# Altium schematic sheet I2C IO Expander.SchDoc: I2C I/O Expander
size 292 x 193 mm; SheetNumber: 3; SheetTotal: 11
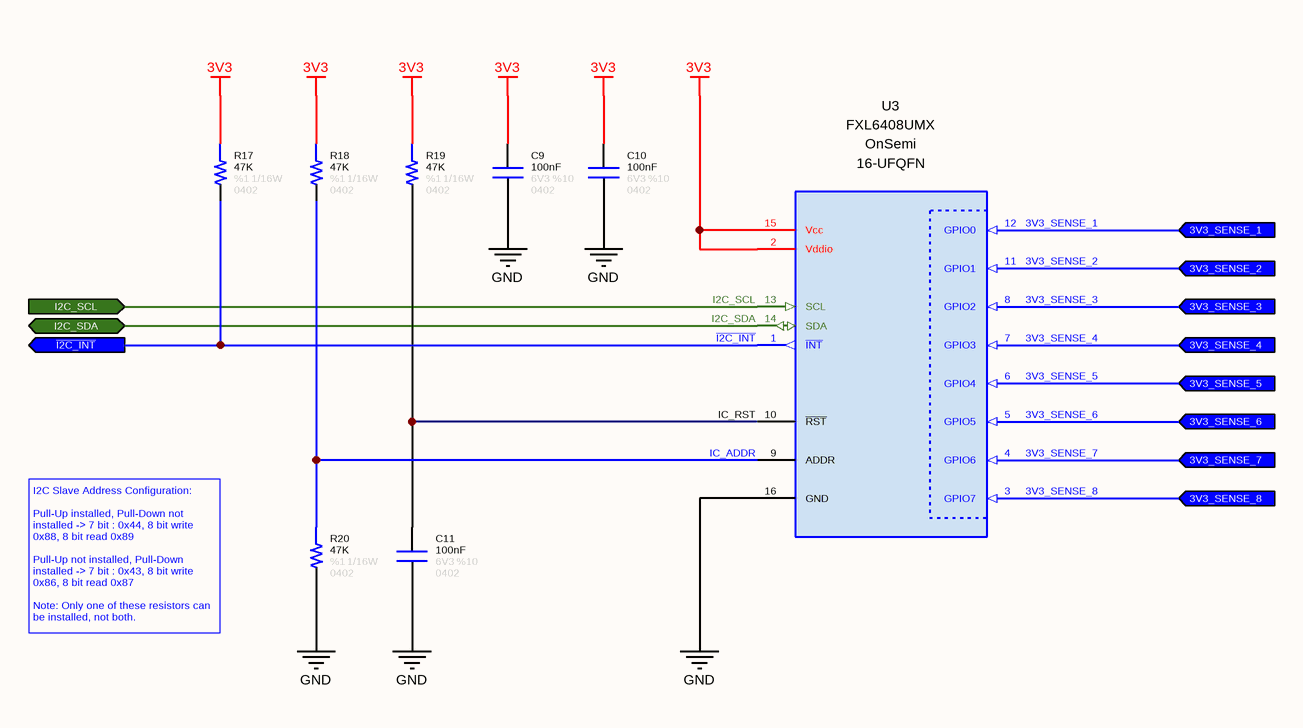
[diagram p0: I2C IO Expander.SchDoc]

## Parts
C9  value 100nF  Tolerance: %10  Voltage: 6V3  Case: 0402  [CAPACITOR_0402]  (hidden comment: Capacitor - 100nF [0402] (Ceramic))
C10  value 100nF  Tolerance: %10  Voltage: 6V3  Case: 0402  [CAPACITOR_0402]  (hidden comment: Capacitor - 100nF [0402] (Ceramic))
C11  value 100nF  Tolerance: %10  Voltage: 6V3  Case: 0402  [CAPACITOR_0402]  (hidden comment: Capacitor - 100nF [0402] (Ceramic))
R17  value 47K  Tolerance: %1  Case: 0402  Power: 1/16W  [RESISTOR_0402]  (hidden comment: 47K - 0402 - %1 - 1/16W)
R18  value 47K  Tolerance: %1  Case: 0402  Power: 1/16W  [RESISTOR_0402]  (hidden comment: 47K - 0402 - %1 - 1/16W)
R19  value 47K  Tolerance: %1  Case: 0402  Power: 1/16W  [RESISTOR_0402]  (hidden comment: 47K - 0402 - %1 - 1/16W)
R20  value 47K  Tolerance: %1  Case: 0402  Power: 1/16W  [RESISTOR_0402]  (hidden comment: 47K - 0402 - %1 - 1/16W)
U3  Manufacturer Part Number: OnSemi  [16-UFQFN]  (hidden comment: FXL6408UMX)

## Ports
3V3_SENSE_1 (in), 3V3_SENSE_2 (in), 3V3_SENSE_3 (in), 3V3_SENSE_4 (in), 3V3_SENSE_5 (in), 3V3_SENSE_6 (in), 3V3_SENSE_7 (in), 3V3_SENSE_8 (in), I2C_SCL (in), I2C_SDA (bidir), ~{I2C_INT} (out)

## Nets
3V3: C9.2 C10.2 R17.2 R18.2 R19.2 U3.2(Vddio) U3.15(Vcc)
GND: C9.1 C10.1 C11.1 R20.1 U3.16(GND)
3V3_SENSE_1: U3.12(GPIO0) ; port 3V3_SENSE_1
3V3_SENSE_2: U3.11(GPIO1) ; port 3V3_SENSE_2
3V3_SENSE_3: U3.8(GPIO2) ; port 3V3_SENSE_3
3V3_SENSE_4: U3.7(GPIO3) ; port 3V3_SENSE_4
3V3_SENSE_5: U3.6(GPIO4) ; port 3V3_SENSE_5
3V3_SENSE_6: U3.5(GPIO5) ; port 3V3_SENSE_6
3V3_SENSE_7: U3.4(GPIO6) ; port 3V3_SENSE_7
3V3_SENSE_8: U3.3(GPIO7) ; port 3V3_SENSE_8
I2C_SCL: U3.13(SCL) ; port I2C_SCL
I2C_SDA: U3.14(SDA) ; port I2C_SDA
~{I2C_INT}: R17.1 U3.1(~{INT}) ; port ~{I2C_INT}
IC_ADDR: R18.1 R20.2 U3.9(ADDR)
IC_RST: C11.2 R19.1 U3.10(~{RST})

## Notes on the sheet
- I2C Slave Address Configuration:
  Pull-Up installed, Pull-Down not installed -> 7 bit : 0x44, 8 bit write 0x88, 8 bit read 0x89
  Pull-Up not installed, Pull-Down installed -> 7 bit : 0x43, 8 bit write 0x86, 8 bit read 0x87
  Note: Only one of these resistors can be installed, not both.
- © 2021 All rights reserved.
  This document may not, in whole or in part, be copied, photocopied, reproduced, translated or converted to any electronic or machine readable from without prior written permission of Mehmet Günce Akkoyun.
  Engineer contact : akkoyun@me.com
- Property of
- Engineer :
- Date :
- Size :
- A4
- Time :
- Project :
- Page :
- /
- Customer :
- Product ID :
- Module ID :
- Version :
- File :
- Revision :

## Library data of the parts
C9-C11 = Capacitor - 100nF [0402-6V3]: Capacitor - 100nF [0402-6V3] (Ceramic); Manufacturer Name: AVX; Manufacturer Part Number: 04026D104KAT4A; ComponentLink1Description: Mouser; ComponentLink1URL: https://www.mouser.com.tr/ProductDetail/AVX/04026D104KAT4A?qs=sGAEpiMZZMs0AnBnWHyRQPg4iYkCw7IMED%2F4kpqgf7w%3D; ComponentLink2Description: DataSheet; ComponentLink2URL: https://www.mouser.com.tr/datasheet/2/40/cx5r-776519.pdf
R17-R20 = Resistor - 47K [0402]: Thick Film Resistors - SMD 1/16 W 47 KOhm 1%; Manufacturer Name: Vishay; Manufacturer Part Number: CRCW040247K0FKED; ComponentLink1Description: DataSheet; ComponentLink1URL: https://www.mouser.com.tr/datasheet/2/427/dcrcwe3-1762152.pdf; ComponentLink2Description: Mouser; ComponentLink2URL: https://www.mouser.com.tr/ProductDetail/Vishay-Dale/CRCW040247K0FKED?qs=sGAEpiMZZMu61qfTUdNhG2DpbjADlD3GL%252B3h1elTxqU%3D
U3 = IC - FXL6408UMX: IC GPIO EXPANDER I2C 8B 16-UMLP; Product Type: I/O Expanders; Manufacturer Name: FXL6408UMX; Case: 16-UFQFN